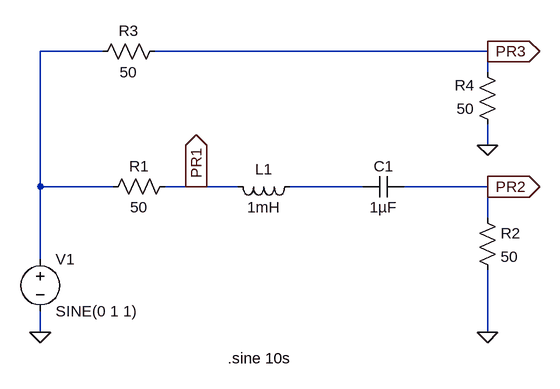
[diagram p0: schematic AC Sweep Simluation.asc]
AC Sweep Simluation.asc, the LTspice schematic file:
Version 4
SHEET 1 936 680
WIRE 256 64 160 64
WIRE 848 64 336 64
WIRE 848 96 848 64
WIRE 848 208 848 176
WIRE 160 272 160 64
WIRE 272 272 160 272
WIRE 400 272 352 272
WIRE 464 272 400 272
WIRE 656 272 544 272
WIRE 848 272 720 272
WIRE 848 320 848 272
WIRE 160 384 160 272
WIRE 160 496 160 464
WIRE 848 496 848 400
FLAG 160 496 0
FLAG 848 496 0
FLAG 848 208 0
FLAG 400 272 PR1
IOPIN 400 272 Out
FLAG 848 272 PR2
IOPIN 848 272 Out
FLAG 848 64 PR3
IOPIN 848 64 Out
SYMBOL Voltage 160 368 R0
SYMATTR InstName V1
SYMATTR Value SINE(0 1 1)
SYMATTR Value2 AC 0
SYMBOL Res 368 256 R90
WINDOW 0 0 56 VBottom 2
WINDOW 3 32 56 VTop 2
SYMATTR InstName R1
SYMATTR Value 50
SYMBOL Res 832 304 R0
SYMATTR InstName R2
SYMATTR Value 50
SYMBOL Res 352 48 R90
WINDOW 0 0 56 VBottom 2
WINDOW 3 32 56 VTop 2
SYMATTR InstName R3
SYMATTR Value 50
SYMBOL Res 864 192 R180
WINDOW 0 36 76 Left 2
WINDOW 3 36 40 Left 2
SYMATTR InstName R4
SYMATTR Value 50
SYMBOL Ind 560 256 R90
WINDOW 0 5 56 VBottom 2
WINDOW 3 32 56 VTop 2
SYMATTR InstName L1
SYMATTR Value 1mH
SYMBOL Cap 720 256 R90
WINDOW 0 0 32 VBottom 2
WINDOW 3 32 32 VTop 2
SYMATTR InstName C1
SYMATTR Value 1µF
TEXT 448 536 Left 2 !.sine 10s

The netlist it stands for:
* AC Sweep Simluation.asc
V1 N001 0 SINE(0 1 1) AC 0
R1 PR1 N001 50
R2 PR2 0 50
R3 PR3 N001 50
R4 0 PR3 50
L1 N002 PR1 1mH
C1 PR2 N002 1µF
.sine 10s
.backanno
.end